# EAGLE design 8LedBoard (EAGLE 7.2.0)
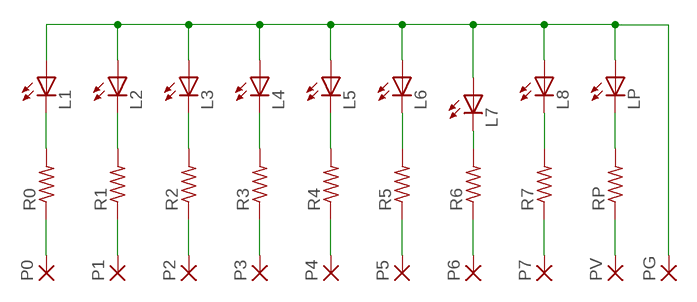
[diagram p0: schematic, sheet 1]

## Parts
L1  LED5MM  [LED5MM]
L2  LED5MM  [LED5MM]
L3  LED5MM  [LED5MM]
L4  LED5MM  [LED5MM]
L5  LED5MM  [LED5MM]
L6  LED5MM  [LED5MM]
L7  LED5MM  [LED5MM]
L8  LED5MM  [LED5MM]
LP  LED5MM  [LED5MM]
P0  1,6/0,9  [1,6/0,9]
P1  1,6/0,9  [1,6/0,9]
P2  1,6/0,9  [1,6/0,9]
P3  1,6/0,9  [1,6/0,9]
P4  1,6/0,9  [1,6/0,9]
P5  1,6/0,9  [1,6/0,9]
P6  1,6/0,9  [1,6/0,9]
P7  1,6/0,9  [1,6/0,9]
PG  1,6/0,9  [1,6/0,9]
PV  1,6/0,9  [1,6/0,9]
R0  R-US_0207/10  [0207/10]
R1  R-US_0207/10  [0207/10]
R2  R-US_0207/10  [0207/10]
R3  R-US_0207/10  [0207/10]
R4  R-US_0207/10  [0207/10]
R5  R-US_0207/10  [0207/10]
R6  R-US_0207/10  [0207/10]
R7  R-US_0207/10  [0207/10]
RP  R-US_0207/10  [0207/10]

## Nets
L3: L3.K(C) R2.2
N$1: P0.1(P) R0.1
N$2: P1.1(P) R1.1
N$3: P2.1(P) R2.1
N$4: L5.K(C) R4.2
N$5: P3.1(P) R3.1
N$6: L6.K(C) R5.2
N$7: P4.1(P) R4.1
N$8: L8.K(C) R7.2
N$9: L1.K(C) R0.2
N$10: L2.K(C) R1.2
N$11: P5.1(P) R5.1
N$12: L4.K(C) R3.2
N$13: L7.K(C) R6.2
N$14: P6.1(P) R6.1
N$15: P7.1(P) R7.1
N$16: PV.1(P) RP.1
N$17: L1.A L2.A L3.A L4.A L5.A L6.A L7.A L8.A LP.A PG.1(P)
N$19: LP.K(C) RP.2

## Library data of the parts
L1-L8 LP = adafruit:LED: LED OSRAM: - CHIPLED LG R971, LG N971, LY N971, LG Q971, LY Q971, LO R971, LY R971 LH N974, LH R974 LS Q976, LO Q976, LY Q976 LO Q996 - Hyper CHIPLED LW Q18S LB Q993, LB Q99A, LB R99A - SideLED LS A670, LO A670, LY A670, LG A670, LP A670 LB A673, LV A673, LT A673, LW A673 LH A674 LY A675 LS A676, LA A676, LO A676, LY A676, LW A676 LS A679, LY A679, LG A679 - Hyper Micro SIDELED® LS Y876, LA Y876, LO Y876, LY Y876 LT Y87S - SmartLED LW L88C, LW L88S LB L89C, LB L89S, LG L890 LS L89K, LO L89K, LY L89K LS L896, LA L896, LO L896, LY L896 - TOPLED LS T670, LO T670, LY T670, LG T670, LP T670 LSG T670, LSP T670, LSY T670, LOP T670, LYG T670 LG T671, LOG T671, LSG T671 LB T673, LV T673, LT T673, LW T673 LH T674 LS T676, LA T676, LO T676, LY T676, LB T676, LH T676, LSB T676, LW T676 LB T67C, LV T67C, LT T67C, LS T67K, LO T67K, LY T67K, LW E67C LS E67B, LA E67B, LO E67B, LY E67B, LB E67C, LV E67C, LT E67C LW T67C LS T679, LY T679, LG T679 LS T770, LO T770, LY T770, LG T770, LP T770 LB T773, LV T773, LT T773, LW T773 LH T774 LS E675, LA E675, LY E675, LS T675 LS T776, LA T776, LO T776, LY T776, LB T776 LHGB T686 LT T68C, LB T68C - Hyper Mini TOPLED® LB M676 - Mini TOPLED Santana® LG M470 LS M47K, LO M47K, LY M47K Source: http://www.osram.convergy.de/
P0 P1-P7 PG PV = wirepad:1,6/0,9: THROUGH-HOLE PAD
R0 R1-R7 RP = adafruit:R-US_: RESISTOR, American symbol

## Board
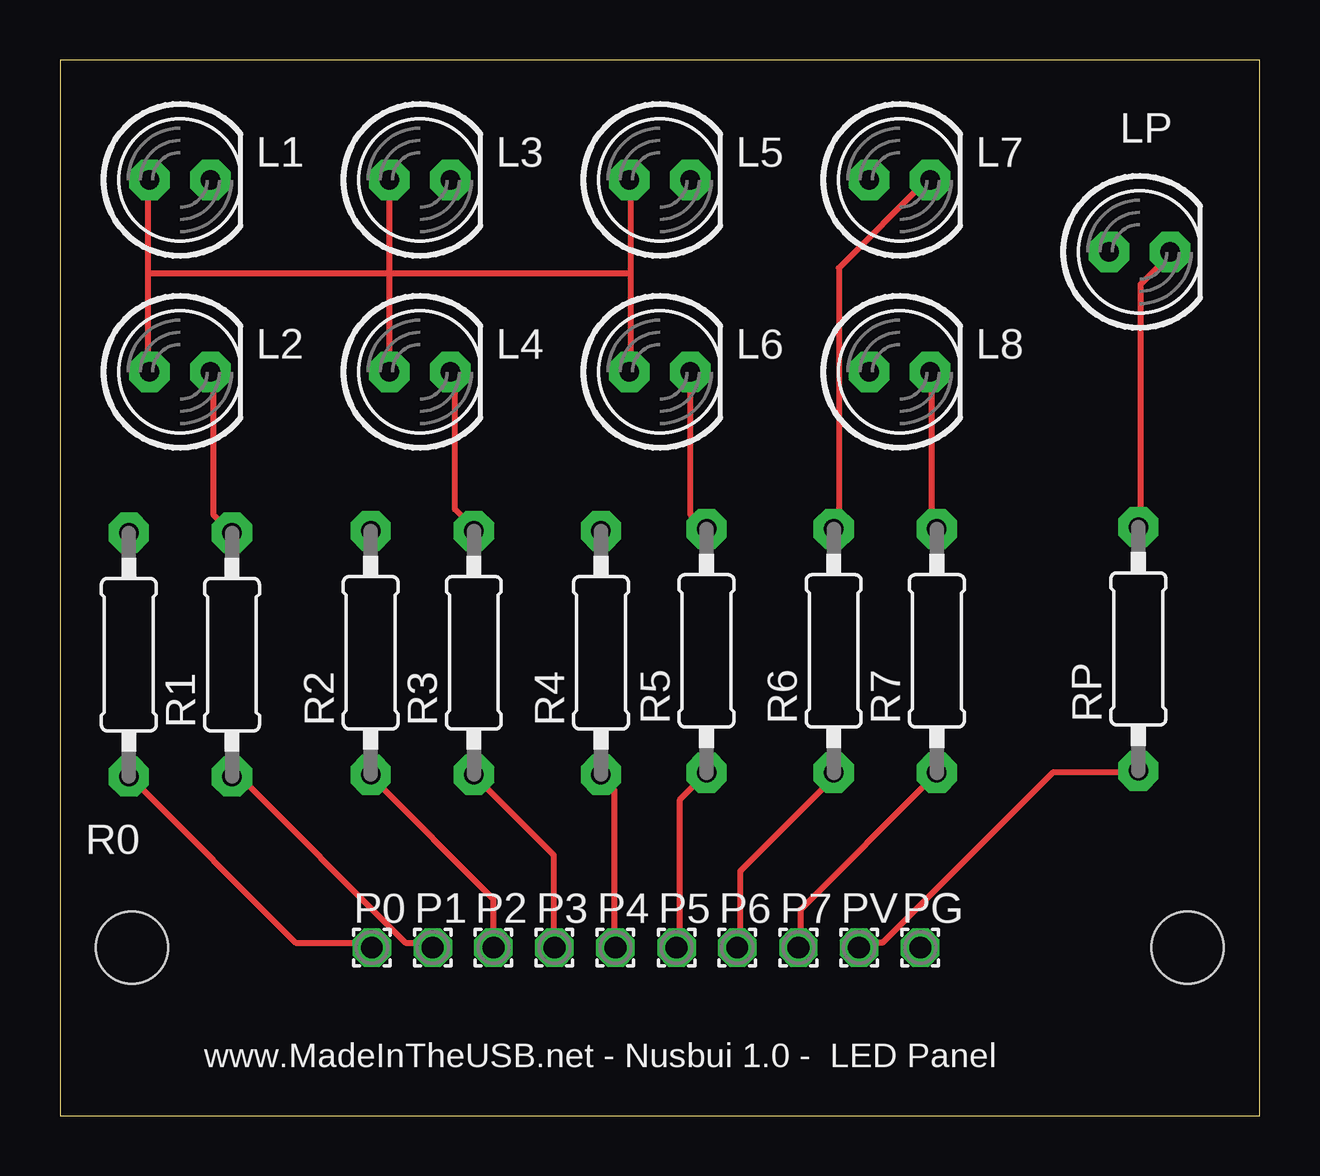
[diagram p1: board, top side]
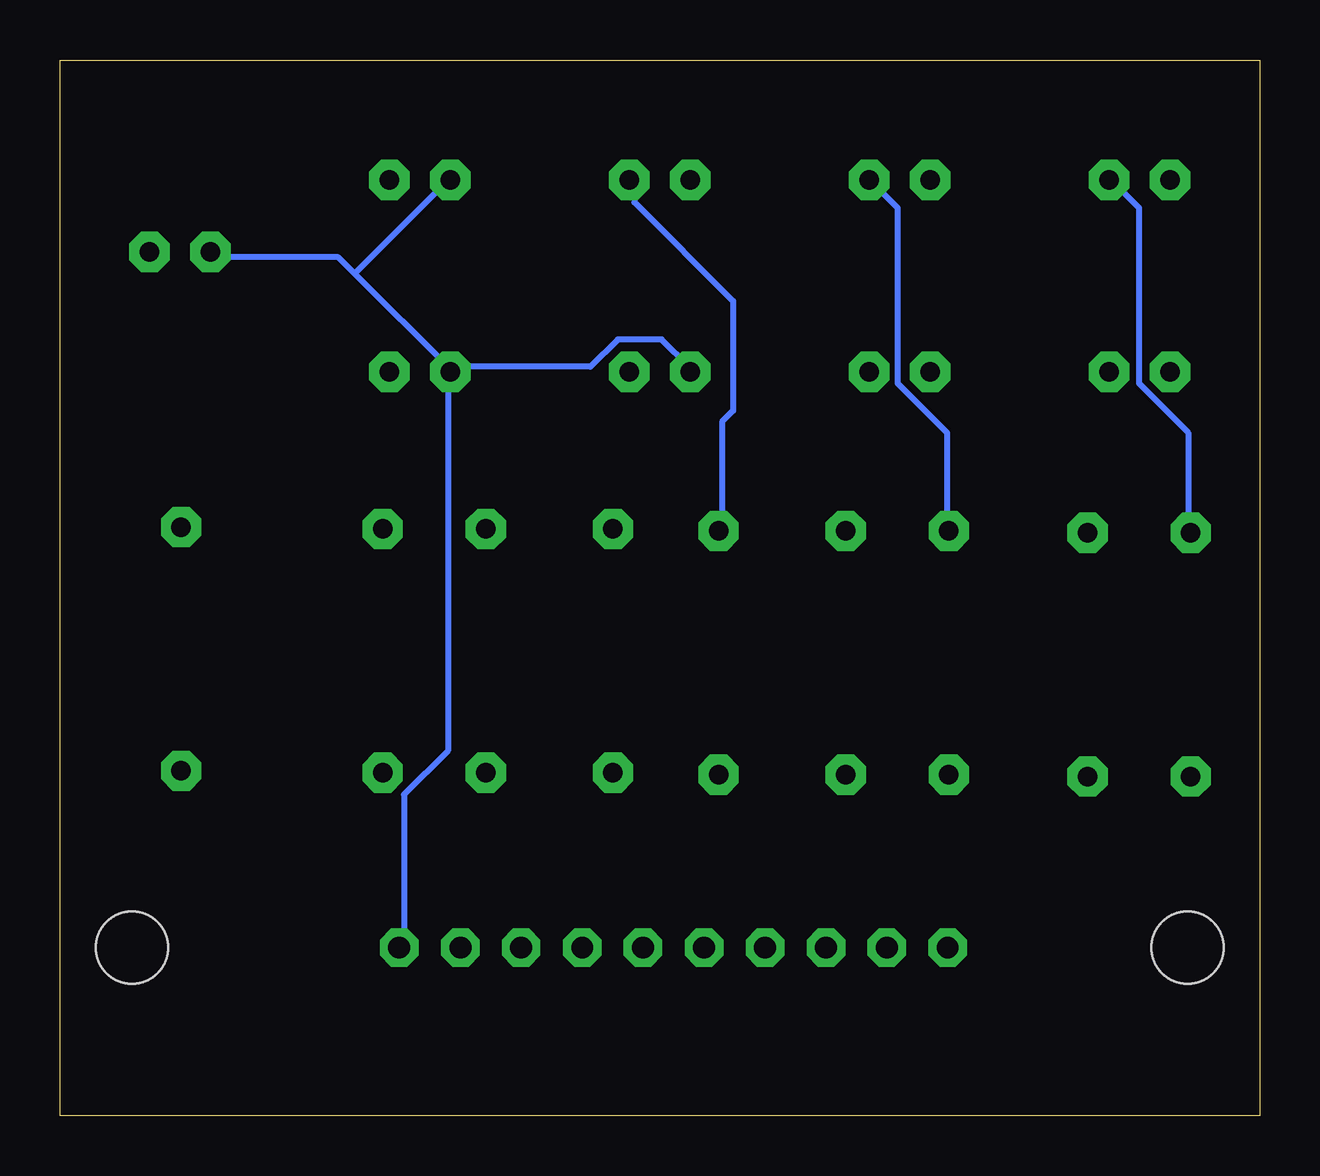
[diagram p2: board, bottom side, seen from below]

Size 50 x 44 mm. Coordinates in mm from the lower left corner, seen from the top.
Outline: 0,0 50,0 50,44 0,44 0,0
Copper layers (1*16): Top 0.035mm / dielectric 1.5mm / Bottom 0.035mm
Design rules "default": minimum track width 10mil, minimum drill 24mil, track to track 8mil, track to pad 8mil, pad to pad 8mil, via to via 8mil, smd to smd 8mil, copper to edge 40mil, drill to drill 8mil, minimum pad ring 10mil, minimum via ring 8mil, stop-mask expansion 4mil, vias tented up to drill 0mil, thermal gap 10mil
Holes 3 mm at 3,7 47,7

### Footprints (pad centres in the part's own frame; a part is rotated, then mirrored left to right if it is on the bottom)
LED5MM = drill 0.813 pad 1.676 octagon: A -1.27,0; K 1.27,0
1,6/0,9 = drill 0.914 pad 1.6 octagon: 1 0,0
0207/10 = drill 0.813 pad 1.676 octagon: 1 -5.08,0; 2 5.08,0

### Placement (x,y rotation side)
L1  5,39 0 top
L2  5,31 0 top
L3  15,39 0 top
L4  15,31 0 top
L5  25,39 0 top
L6  25,31 0 top
L7  35,39 0 top
L8  35,31 0 top
LP  45,36 0 top
P0  13,7 0 top
P1  15.54,7 0 top
P2  18.07,7 0 top
P3  20.61,7 0 top
P4  23.15,7 0 top
P5  25.7,7 0 top
P6  28.23,7 0 top
P7  30.78,7 0 top
PG  35.86,7 0 top
PV  33.31,7 0 top
R0  2.87,19.21 90 top
R1  7.17,19.21 90 top
R2  12.95,19.29 90 top
R3  17.25,19.29 90 top
R4  22.55,19.29 90 top
R5  26.95,19.37 90 top
R6  32.25,19.37 90 top
R7  36.55,19.37 90 top
RP  44.95,19.45 90 top

### Tracks (layer width: path | path; a pad name or v marks a point on that pad's centre or on a via)
L3
  Bottom 0.254: R2.2 13.03,24.58 13.03,28.47 15.09,30.52 15.09,37.84 16.23,38.98 L3.K
N$1
  Top 0.254: P0.1 12.8,7.2 9.83,7.2 2.97,14.06 R0.1
N$2
  Top 0.254: P1.1 15.32,7.2 14.4,7.2 7.32,14.29 R1.1
N$3
  Top 0.254: P2.1 18.06,7.2 18.06,9.03 13.03,14.06 R2.1
N$4
  Bottom 0.254: R4.2 22.4,24.58 22.4,28.92 21.95,29.38 21.95,33.95 26.06,38.07 26.06,38.98 L5.K
N$5
  Top 0.254: P3.1 20.57,7.2 20.57,10.86 17.37,14.06 R3.1
N$6
  Top 0.254: L6.K 26.29,30.98 26.29,25.04 26.75,24.58 R5.2
N$7
  Top 0.254: P4.1 23.09,7.2 23.09,13.61 22.63,14.06 R4.1
N$8
  Top 0.254: L8.K 36.35,30.98 36.35,24.58 R7.2
N$9
  Bottom 0.254: R0.2 2.97,24.35 2.97,28.47 5.03,30.52 5.03,37.84 6.17,38.98 L1.K
N$10
  Top 0.254: L2.K 6.4,30.98 6.4,25.04 7.09,24.35 R1.2
N$11
  Top 0.254: P5.1 25.83,7.2 25.83,13.15 26.75,14.06 R5.1
N$12
  Top 0.254: L4.K 16.46,30.98 16.46,25.27 17.14,24.58 R3.2
N$13
  Top 0.254: R6.2 32.46,24.58 32.46,35.32 36.12,38.98 L7.K
N$14
  Top 0.254: P6.1 28.35,7.2 28.35,10.18 32.23,14.06 R6.1
N$15
  Top 0.254: P7.1 30.86,7.2 30.86,8.58 36.35,14.06 R7.1
N$16
  Top 0.254: PV.1 33.38,7.2 34.29,7.2 41.38,14.29 44.81,14.29 RP.1
N$17
  Top 0.254: 3.66,35.09 3.66,38.98 L1.A | 3.66,35.09 3.66,31.21 L2.A | 13.72,35.09 13.72,38.98 L3.A | 13.72,35.09 13.72,31.21 L4.A | 13.72,35.09 3.66,35.09 | 23.77,35.09 23.77,38.98 L5.A | 23.77,35.09 23.77,31.21 L6.A | 23.77,35.09 13.72,35.09
  Bottom 0.254: L8.A 33.6,31.21 27.89,31.21 26.75,32.35 24.92,32.35 23.77,31.21 L6.A | 37.72,35.09 33.83,31.21 L8.A | 37.72,35.09 38.41,35.78 43.66,35.78 LP.A | 37.72,35.09 33.83,38.98 L7.A | PG.1 35.66,7.2 35.66,13.38 33.83,15.21 33.83,30.98 L8.A
N$19
  Top 0.254: RP.2 45.03,24.58 45.03,34.64 46.18,35.78 LP.K

### Text on the board
tNames: www.MadeInTheUSB.net - Nusbui 1.0 - LED Panel